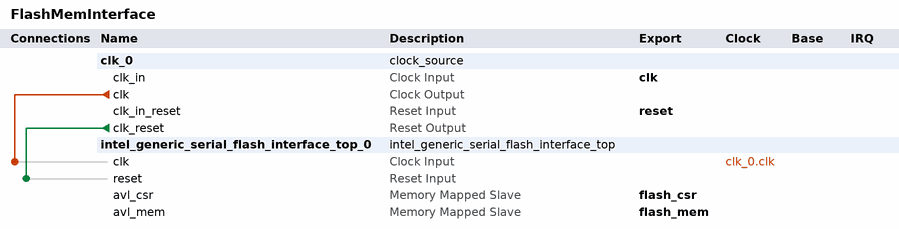
[diagram p0: system contents]
# Platform Designer (Qsys) system FlashMemInterface, Cyclone V 5CSEMA5F31C6
# Parameters at their usual value, and those the tool derives, are not listed.
package require -exact qsys 18.1
create_system FlashMemInterface
set_project_property DEVICE_FAMILY {Cyclone V}
set_project_property DEVICE 5CSEMA5F31C6

add_instance clk_0 clock_source 18.1
set_instance_parameter_value clk_0 clockFrequency 50000000

add_instance intel_generic_serial_flash_interface_top_0 intel_generic_serial_flash_interface_top 18.1
set_instance_parameter_value intel_generic_serial_flash_interface_top_0 CHIP_SELECT_BYPASS false
set_instance_parameter_value intel_generic_serial_flash_interface_top_0 CHIP_SELS 1
set_instance_parameter_value intel_generic_serial_flash_interface_top_0 DEBUG_OPTION 0
set_instance_parameter_value intel_generic_serial_flash_interface_top_0 DEFAULT_VALUE_REG_0 1
set_instance_parameter_value intel_generic_serial_flash_interface_top_0 DEFAULT_VALUE_REG_1 16
set_instance_parameter_value intel_generic_serial_flash_interface_top_0 DEFAULT_VALUE_REG_2 0
set_instance_parameter_value intel_generic_serial_flash_interface_top_0 DEFAULT_VALUE_REG_3 0
set_instance_parameter_value intel_generic_serial_flash_interface_top_0 DEFAULT_VALUE_REG_4 0
set_instance_parameter_value intel_generic_serial_flash_interface_top_0 DEFAULT_VALUE_REG_5 3
set_instance_parameter_value intel_generic_serial_flash_interface_top_0 DEFAULT_VALUE_REG_6 28674
set_instance_parameter_value intel_generic_serial_flash_interface_top_0 DEFAULT_VALUE_REG_7 6149
set_instance_parameter_value intel_generic_serial_flash_interface_top_0 DEVICE_DENSITY 256
set_instance_parameter_value intel_generic_serial_flash_interface_top_0 ENABLE_SIM_MODEL false
set_instance_parameter_value intel_generic_serial_flash_interface_top_0 PIPE_CMD_GEN_CMD 0
set_instance_parameter_value intel_generic_serial_flash_interface_top_0 PIPE_CSR 0
set_instance_parameter_value intel_generic_serial_flash_interface_top_0 PIPE_MUX_CMD 0
set_instance_parameter_value intel_generic_serial_flash_interface_top_0 PIPE_XIP 0
set_instance_parameter_value intel_generic_serial_flash_interface_top_0 USE_CHIP_SEL_FROM_CSR 1
set_instance_parameter_value intel_generic_serial_flash_interface_top_0 gui_use_asmiblock false
set_instance_parameter_value intel_generic_serial_flash_interface_top_0 gui_use_gpio false

# connections
add_connection clk_0.clk intel_generic_serial_flash_interface_top_0.clk clock
add_connection clk_0.clk_reset intel_generic_serial_flash_interface_top_0.reset reset

# exported interfaces
add_interface clk clock sink
set_interface_property clk EXPORT_OF clk_0.clk_in
add_interface flash_csr avalon slave
set_interface_property flash_csr EXPORT_OF intel_generic_serial_flash_interface_top_0.avl_csr
add_interface flash_mem avalon slave
set_interface_property flash_mem EXPORT_OF intel_generic_serial_flash_interface_top_0.avl_mem
add_interface reset reset sink
set_interface_property reset EXPORT_OF clk_0.clk_in_reset

set_interconnect_requirement {$system} qsys_mm.clockCrossingAdapter HANDSHAKE
set_interconnect_requirement {$system} qsys_mm.enableEccProtection FALSE
set_interconnect_requirement {$system} qsys_mm.insertDefaultSlave FALSE
set_interconnect_requirement {$system} qsys_mm.maxAdditionalLatency 1

save_system FlashMemInterface.qsys
